# Altium project HexMatrix.PrjPcb
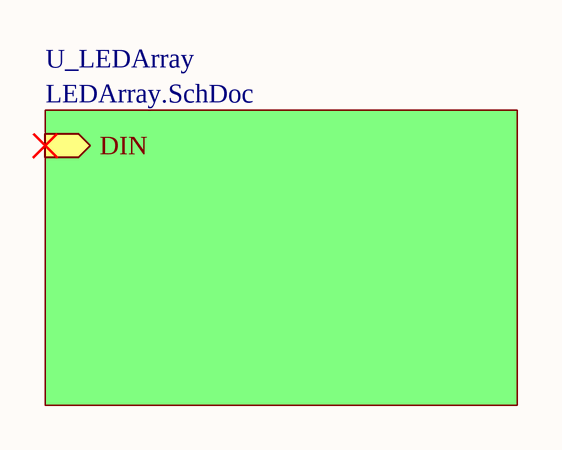
[diagram p0: Func.SchDoc]
3 sheets, 185 parts. Net scope: hierarchical (ports join the sheet entries above them; power ports are global).
Board file: RawLEDArray.PcbDoc
Sheets:
  Func.SchDoc
    U_LEDArray = LEDArray.SchDoc
      U_LED1 = LED.SchDoc
      U_LED2 = LED.SchDoc
      U_LED3 = LED.SchDoc
      U_LED4 = LED.SchDoc
      U_LED5 = LED.SchDoc
      U_LED6 = LED.SchDoc
      U_LED7 = LED.SchDoc
      U_LED8 = LED.SchDoc
      U_LED9 = LED.SchDoc
      U_LED10 = LED.SchDoc
      U_LED11 = LED.SchDoc
      U_LED12 = LED.SchDoc
      U_LED13 = LED.SchDoc
      U_LED14 = LED.SchDoc
      U_LED15 = LED.SchDoc
      U_LED16 = LED.SchDoc
      U_LED17 = LED.SchDoc
      U_LED18 = LED.SchDoc
      U_LED19 = LED.SchDoc
      U_LED20 = LED.SchDoc
      U_LED21 = LED.SchDoc
      U_LED22 = LED.SchDoc
      U_LED23 = LED.SchDoc
      U_LED24 = LED.SchDoc
      U_LED25 = LED.SchDoc
      U_LED26 = LED.SchDoc
      U_LED27 = LED.SchDoc
      U_LED28 = LED.SchDoc
      U_LED29 = LED.SchDoc
      U_LED30 = LED.SchDoc
      U_LED31 = LED.SchDoc
      U_LED32 = LED.SchDoc
      U_LED33 = LED.SchDoc
      U_LED34 = LED.SchDoc
      U_LED35 = LED.SchDoc
      U_LED36 = LED.SchDoc
      U_LED37 = LED.SchDoc
      U_LED38 = LED.SchDoc
      U_LED39 = LED.SchDoc
      U_LED40 = LED.SchDoc
      U_LED41 = LED.SchDoc
      U_LED42 = LED.SchDoc
      U_LED43 = LED.SchDoc
      U_LED44 = LED.SchDoc
      U_LED45 = LED.SchDoc
      U_LED46 = LED.SchDoc
      U_LED47 = LED.SchDoc
      U_LED48 = LED.SchDoc
      U_LED49 = LED.SchDoc
      U_LED50 = LED.SchDoc
      U_LED51 = LED.SchDoc
      U_LED52 = LED.SchDoc
      U_LED53 = LED.SchDoc
      U_LED54 = LED.SchDoc
      U_LED55 = LED.SchDoc
      U_LED56 = LED.SchDoc
      U_LED57 = LED.SchDoc
      U_LED58 = LED.SchDoc
      U_LED59 = LED.SchDoc
      U_LED60 = LED.SchDoc
      U_LED61 = LED.SchDoc
      U_LED62 = LED.SchDoc
      U_LED63 = LED.SchDoc
      U_LED64 = LED.SchDoc
      U_LED65 = LED.SchDoc
      U_LED66 = LED.SchDoc
      U_LED67 = LED.SchDoc
      U_LED68 = LED.SchDoc
      U_LED69 = LED.SchDoc
      U_LED70 = LED.SchDoc
      U_LED71 = LED.SchDoc
      U_LED72 = LED.SchDoc
      U_LED73 = LED.SchDoc
      U_LED74 = LED.SchDoc
      U_LED75 = LED.SchDoc
      U_LED76 = LED.SchDoc
      U_LED77 = LED.SchDoc
      U_LED78 = LED.SchDoc
      U_LED79 = LED.SchDoc
      U_LED80 = LED.SchDoc
      U_LED81 = LED.SchDoc
      U_LED82 = LED.SchDoc
      U_LED83 = LED.SchDoc
      U_LED84 = LED.SchDoc
      U_LED85 = LED.SchDoc
      U_LED86 = LED.SchDoc
      U_LED87 = LED.SchDoc
      U_LED88 = LED.SchDoc
      U_LED89 = LED.SchDoc
      U_LED90 = LED.SchDoc
      U_LED91 = LED.SchDoc
      U_LED92 = LED.SchDoc

## Sheet Func.SchDoc
size A4; DocumentNumber: 1; SheetNumber: 1; SheetTotal: 3

### Sub-sheets
U_LEDArray = LEDArray.SchDoc: DIN (in)

## Sheet LEDArray.SchDoc
size A4; DocumentNumber: 2; SheetNumber: 2; SheetTotal: 3
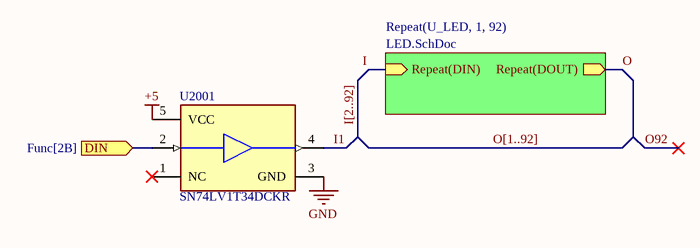
[diagram p1: LEDArray.SchDoc]

### Parts
U2001  SN74LV1T34DCKR  [FP-DCK0005A-IPC_C]

### Sub-sheets
Repeat(U_LED, 1, 92) = LED.SchDoc: Repeat(DOUT) (out), Repeat(DIN) (in)

### Ports
DIN (in, see Func[2B])

### Nets
+5: U2001.5(VCC)
GND: U2001.3(GND)
I: sheet Repeat(U_LED, 1, 92)/Repeat(DIN)
I1: U2001.4(Y)
O: sheet Repeat(U_LED, 1, 92)/Repeat(DOUT)
NetU2001_2: U2001.2(A) ; port DIN

Not connected (* = marked no-connect by the designer): U2001 1(NC)*

### Buses and harness runs
bus I[2..92] = O[1..92]

### Library data of the parts
U2001 = CMP-0859-00371-4: IC BUF NON-INVERT 5.5V SC70-5; Number of Outputs: 1; Polarity: Non-Inverting; Quiescent Current: 1uA; High Level Output Current: -8mA; Operating Supply Current: 8mA; Propagation Delay: 15.5ns; Logic Function: Buffer; Min Supply Voltage: 1.6V; Max Operating Temperature: 125°C; Weight: 0.000215oz; Number of Pins: 5; Number of Channels: 1; Mount: Surface Mount; Number of Input Lines: 1; Lead Free: Lead Free; Min Operating Temperature: -40°C; Radiation Hardening: No; Number of Inputs: 1; Number of Elements: 1; REACH SVHC: No SVHC; Packaging: Tape and Reel; Package Quantity: 3000; Case/Package: SC; Number of Bits: 1; Low Level Output Current: 8mA; Max Supply Voltage: 5.5V; Contact Plating: Gold; Number of Bits per Element: 1; Number of Output Lines: 1

## Sheet LED.SchDoc: WS2812B 8mm LED
size A4; DrawnBy: Denis Cooper; Engineer: Denis Cooper; DocumentNumber: 3; Revision: 0.1; SheetNumber: 3; SheetTotal: 3
Used 92 times, as channels U_LEDArray/U_LED1, U_LEDArray/U_LED2, U_LEDArray/U_LED3, U_LEDArray/U_LED4, U_LEDArray/U_LED5, U_LEDArray/U_LED6, U_LEDArray/U_LED7, U_LEDArray/U_LED8, U_LEDArray/U_LED9, U_LEDArray/U_LED10, U_LEDArray/U_LED11, U_LEDArray/U_LED12, U_LEDArray/U_LED13, U_LEDArray/U_LED14, U_LEDArray/U_LED15, U_LEDArray/U_LED16, U_LEDArray/U_LED17, U_LEDArray/U_LED18, U_LEDArray/U_LED19, U_LEDArray/U_LED20, U_LEDArray/U_LED21, U_LEDArray/U_LED22, U_LEDArray/U_LED23, U_LEDArray/U_LED24, U_LEDArray/U_LED25, U_LEDArray/U_LED26, U_LEDArray/U_LED27, U_LEDArray/U_LED28, U_LEDArray/U_LED29, U_LEDArray/U_LED30, U_LEDArray/U_LED31, U_LEDArray/U_LED32, U_LEDArray/U_LED33, U_LEDArray/U_LED34, U_LEDArray/U_LED35, U_LEDArray/U_LED36, U_LEDArray/U_LED37, U_LEDArray/U_LED38, U_LEDArray/U_LED39, U_LEDArray/U_LED40, U_LEDArray/U_LED41, U_LEDArray/U_LED42, U_LEDArray/U_LED43, U_LEDArray/U_LED44, U_LEDArray/U_LED45, U_LEDArray/U_LED46, U_LEDArray/U_LED47, U_LEDArray/U_LED48, U_LEDArray/U_LED49, U_LEDArray/U_LED50, U_LEDArray/U_LED51, U_LEDArray/U_LED52, U_LEDArray/U_LED53, U_LEDArray/U_LED54, U_LEDArray/U_LED55, U_LEDArray/U_LED56, U_LEDArray/U_LED57, U_LEDArray/U_LED58, U_LEDArray/U_LED59, U_LEDArray/U_LED60, U_LEDArray/U_LED61, U_LEDArray/U_LED62, U_LEDArray/U_LED63, U_LEDArray/U_LED64, U_LEDArray/U_LED65, U_LEDArray/U_LED66, U_LEDArray/U_LED67, U_LEDArray/U_LED68, U_LEDArray/U_LED69, U_LEDArray/U_LED70, U_LEDArray/U_LED71, U_LEDArray/U_LED72, U_LEDArray/U_LED73, U_LEDArray/U_LED74, U_LEDArray/U_LED75, U_LEDArray/U_LED76, U_LEDArray/U_LED77, U_LEDArray/U_LED78, U_LEDArray/U_LED79, U_LEDArray/U_LED80, U_LEDArray/U_LED81, U_LEDArray/U_LED82, U_LEDArray/U_LED83, U_LEDArray/U_LED84, U_LEDArray/U_LED85, U_LEDArray/U_LED86, U_LEDArray/U_LED87, U_LEDArray/U_LED88, U_LEDArray/U_LED89, U_LEDArray/U_LED90, U_LEDArray/U_LED91, U_LEDArray/U_LED92. Parts and nets are listed once, with the designators drawn on the sheet.
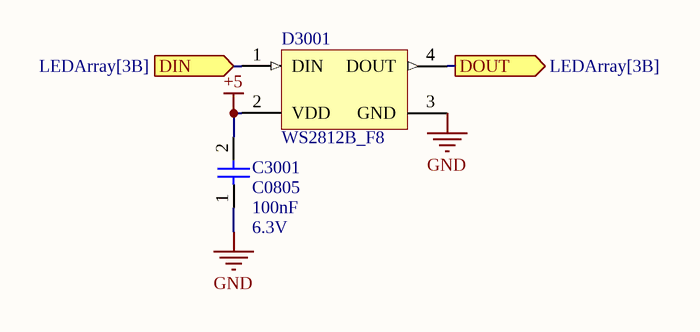
[diagram p2: LED.SchDoc]

### Parts
C3001  C0805  Capacitance: 100nF  Voltage: 6.3V  [CC0805]
D3001  WS2812B_F8  [WS2812B_F8]

### Ports
DIN (in, see LEDArray[3B]), DOUT (out, see LEDArray[3B])

### Nets
+5: C3001.2 D3001.2(VDD)
GND: C3001.1 D3001.3(GND)
DIN: D3001.1(DIN) ; port DIN
DOUT: D3001.4(DOUT) ; port DOUT

### Channels
U_LEDArray/U_LED1: designators end in _1; ports DIN=I1 DOUT=I2
U_LEDArray/U_LED2: designators end in _2; ports DIN=I2 DOUT=I3
U_LEDArray/U_LED3: designators end in _3; ports DIN=I3 DOUT=I4
U_LEDArray/U_LED4: designators end in _4; ports DIN=I4 DOUT=I5
U_LEDArray/U_LED5: designators end in _5; ports DIN=I5 DOUT=I6
U_LEDArray/U_LED6: designators end in _6; ports DIN=I6 DOUT=I7
U_LEDArray/U_LED7: designators end in _7; ports DIN=I7 DOUT=I8
U_LEDArray/U_LED8: designators end in _8; ports DIN=I8 DOUT=I9
U_LEDArray/U_LED9: designators end in _9; ports DIN=I9 DOUT=I10
U_LEDArray/U_LED10: designators end in _10; ports DIN=I10 DOUT=I11
U_LEDArray/U_LED11: designators end in _11; ports DIN=I11 DOUT=I12
U_LEDArray/U_LED12: designators end in _12; ports DIN=I12 DOUT=I13
U_LEDArray/U_LED13: designators end in _13; ports DIN=I13 DOUT=I14
U_LEDArray/U_LED14: designators end in _14; ports DIN=I14 DOUT=I15
U_LEDArray/U_LED15: designators end in _15; ports DIN=I15 DOUT=I16
U_LEDArray/U_LED16: designators end in _16; ports DIN=I16 DOUT=I17
U_LEDArray/U_LED17: designators end in _17; ports DIN=I17 DOUT=I18
U_LEDArray/U_LED18: designators end in _18; ports DIN=I18 DOUT=I19
U_LEDArray/U_LED19: designators end in _19; ports DIN=I19 DOUT=I20
U_LEDArray/U_LED20: designators end in _20; ports DIN=I20 DOUT=I21
U_LEDArray/U_LED21: designators end in _21; ports DIN=I21 DOUT=I22
U_LEDArray/U_LED22: designators end in _22; ports DIN=I22 DOUT=I23
U_LEDArray/U_LED23: designators end in _23; ports DIN=I23 DOUT=I24
U_LEDArray/U_LED24: designators end in _24; ports DIN=I24 DOUT=I25
U_LEDArray/U_LED25: designators end in _25; ports DIN=I25 DOUT=I26
U_LEDArray/U_LED26: designators end in _26; ports DIN=I26 DOUT=I27
U_LEDArray/U_LED27: designators end in _27; ports DIN=I27 DOUT=I28
U_LEDArray/U_LED28: designators end in _28; ports DIN=I28 DOUT=I29
U_LEDArray/U_LED29: designators end in _29; ports DIN=I29 DOUT=I30
U_LEDArray/U_LED30: designators end in _30; ports DIN=I30 DOUT=I31
U_LEDArray/U_LED31: designators end in _31; ports DIN=I31 DOUT=I32
U_LEDArray/U_LED32: designators end in _32; ports DIN=I32 DOUT=I33
U_LEDArray/U_LED33: designators end in _33; ports DIN=I33 DOUT=I34
U_LEDArray/U_LED34: designators end in _34; ports DIN=I34 DOUT=I35
U_LEDArray/U_LED35: designators end in _35; ports DIN=I35 DOUT=I36
U_LEDArray/U_LED36: designators end in _36; ports DIN=I36 DOUT=I37
U_LEDArray/U_LED37: designators end in _37; ports DIN=I37 DOUT=I38
U_LEDArray/U_LED38: designators end in _38; ports DIN=I38 DOUT=I39
U_LEDArray/U_LED39: designators end in _39; ports DIN=I39 DOUT=I40
U_LEDArray/U_LED40: designators end in _40; ports DIN=I40 DOUT=I41
U_LEDArray/U_LED41: designators end in _41; ports DIN=I41 DOUT=I42
U_LEDArray/U_LED42: designators end in _42; ports DIN=I42 DOUT=I43
U_LEDArray/U_LED43: designators end in _43; ports DIN=I43 DOUT=I44
U_LEDArray/U_LED44: designators end in _44; ports DIN=I44 DOUT=I45
U_LEDArray/U_LED45: designators end in _45; ports DIN=I45 DOUT=I46
U_LEDArray/U_LED46: designators end in _46; ports DIN=I46 DOUT=I47
U_LEDArray/U_LED47: designators end in _47; ports DIN=I47 DOUT=I48
U_LEDArray/U_LED48: designators end in _48; ports DIN=I48 DOUT=I49
U_LEDArray/U_LED49: designators end in _49; ports DIN=I49 DOUT=I50
U_LEDArray/U_LED50: designators end in _50; ports DIN=I50 DOUT=I51
U_LEDArray/U_LED51: designators end in _51; ports DIN=I51 DOUT=I52
U_LEDArray/U_LED52: designators end in _52; ports DIN=I52 DOUT=I53
U_LEDArray/U_LED53: designators end in _53; ports DIN=I53 DOUT=I54
U_LEDArray/U_LED54: designators end in _54; ports DIN=I54 DOUT=I55
U_LEDArray/U_LED55: designators end in _55; ports DIN=I55 DOUT=I56
U_LEDArray/U_LED56: designators end in _56; ports DIN=I56 DOUT=I57
U_LEDArray/U_LED57: designators end in _57; ports DIN=I57 DOUT=I58
U_LEDArray/U_LED58: designators end in _58; ports DIN=I58 DOUT=I59
U_LEDArray/U_LED59: designators end in _59; ports DIN=I59 DOUT=I60
U_LEDArray/U_LED60: designators end in _60; ports DIN=I60 DOUT=I61
U_LEDArray/U_LED61: designators end in _61; ports DIN=I61 DOUT=I62
U_LEDArray/U_LED62: designators end in _62; ports DIN=I62 DOUT=I63
U_LEDArray/U_LED63: designators end in _63; ports DIN=I63 DOUT=I64
U_LEDArray/U_LED64: designators end in _64; ports DIN=I64 DOUT=I65
U_LEDArray/U_LED65: designators end in _65; ports DIN=I65 DOUT=I66
U_LEDArray/U_LED66: designators end in _66; ports DIN=I66 DOUT=I67
U_LEDArray/U_LED67: designators end in _67; ports DIN=I67 DOUT=I68
U_LEDArray/U_LED68: designators end in _68; ports DIN=I68 DOUT=I69
U_LEDArray/U_LED69: designators end in _69; ports DIN=I69 DOUT=I70
U_LEDArray/U_LED70: designators end in _70; ports DIN=I70 DOUT=I71
U_LEDArray/U_LED71: designators end in _71; ports DIN=I71 DOUT=I72
U_LEDArray/U_LED72: designators end in _72; ports DIN=I72 DOUT=I73
U_LEDArray/U_LED73: designators end in _73; ports DIN=I73 DOUT=I74
U_LEDArray/U_LED74: designators end in _74; ports DIN=I74 DOUT=I75
U_LEDArray/U_LED75: designators end in _75; ports DIN=I75 DOUT=I76
U_LEDArray/U_LED76: designators end in _76; ports DIN=I76 DOUT=I77
U_LEDArray/U_LED77: designators end in _77; ports DIN=I77 DOUT=I78
U_LEDArray/U_LED78: designators end in _78; ports DIN=I78 DOUT=I79
U_LEDArray/U_LED79: designators end in _79; ports DIN=I79 DOUT=I80
U_LEDArray/U_LED80: designators end in _80; ports DIN=I80 DOUT=I81
U_LEDArray/U_LED81: designators end in _81; ports DIN=I81 DOUT=I82
U_LEDArray/U_LED82: designators end in _82; ports DIN=I82 DOUT=I83
U_LEDArray/U_LED83: designators end in _83; ports DIN=I83 DOUT=I84
U_LEDArray/U_LED84: designators end in _84; ports DIN=I84 DOUT=I85
U_LEDArray/U_LED85: designators end in _85; ports DIN=I85 DOUT=I86
U_LEDArray/U_LED86: designators end in _86; ports DIN=I86 DOUT=I87
U_LEDArray/U_LED87: designators end in _87; ports DIN=I87 DOUT=I88
U_LEDArray/U_LED88: designators end in _88; ports DIN=I88 DOUT=I89
U_LEDArray/U_LED89: designators end in _89; ports DIN=I89 DOUT=I90
U_LEDArray/U_LED90: designators end in _90; ports DIN=I90 DOUT=I91
U_LEDArray/U_LED91: designators end in _91; ports DIN=I91 DOUT=I92
U_LEDArray/U_LED92: designators end in _92; ports DIN=I92 DOUT=O92

### Library data of the parts
C3001 = C0805: Capacitor; Tolerance: ±?%
D3001 = WS2812B_F8: Addressable 8mm LED; Voltage: 5V

## Nets that join several sheets
+5: LEDArray (U2001.5), U_LEDArray/U_LED1 (C3001_1.2 D3001_1.2), U_LEDArray/U_LED2 (C3001_2.2 D3001_2.2), U_LEDArray/U_LED3 (C3001_3.2 D3001_3.2), U_LEDArray/U_LED4 (C3001_4.2 D3001_4.2), U_LEDArray/U_LED5 (C3001_5.2 D3001_5.2), U_LEDArray/U_LED6 (C3001_6.2 D3001_6.2), U_LEDArray/U_LED7 (C3001_7.2 D3001_7.2), U_LEDArray/U_LED8 (C3001_8.2 D3001_8.2), U_LEDArray/U_LED9 (C3001_9.2 D3001_9.2), U_LEDArray/U_LED10 (C3001_10.2 D3001_10.2), U_LEDArray/U_LED11 (C3001_11.2 D3001_11.2), U_LEDArray/U_LED12 (C3001_12.2 D3001_12.2), U_LEDArray/U_LED13 (C3001_13.2 D3001_13.2), U_LEDArray/U_LED14 (C3001_14.2 D3001_14.2), U_LEDArray/U_LED15 (C3001_15.2 D3001_15.2), U_LEDArray/U_LED16 (C3001_16.2 D3001_16.2), U_LEDArray/U_LED17 (C3001_17.2 D3001_17.2), U_LEDArray/U_LED18 (C3001_18.2 D3001_18.2), U_LEDArray/U_LED19 (C3001_19.2 D3001_19.2), U_LEDArray/U_LED20 (C3001_20.2 D3001_20.2), U_LEDArray/U_LED21 (C3001_21.2 D3001_21.2), U_LEDArray/U_LED22 (C3001_22.2 D3001_22.2), U_LEDArray/U_LED23 (C3001_23.2 D3001_23.2), U_LEDArray/U_LED24 (C3001_24.2 D3001_24.2), U_LEDArray/U_LED25 (C3001_25.2 D3001_25.2), U_LEDArray/U_LED26 (C3001_26.2 D3001_26.2), U_LEDArray/U_LED27 (C3001_27.2 D3001_27.2), U_LEDArray/U_LED28 (C3001_28.2 D3001_28.2), U_LEDArray/U_LED29 (C3001_29.2 D3001_29.2), U_LEDArray/U_LED30 (C3001_30.2 D3001_30.2), U_LEDArray/U_LED31 (C3001_31.2 D3001_31.2), U_LEDArray/U_LED32 (C3001_32.2 D3001_32.2), U_LEDArray/U_LED33 (C3001_33.2 D3001_33.2), U_LEDArray/U_LED34 (C3001_34.2 D3001_34.2), U_LEDArray/U_LED35 (C3001_35.2 D3001_35.2), U_LEDArray/U_LED36 (C3001_36.2 D3001_36.2), U_LEDArray/U_LED37 (C3001_37.2 D3001_37.2), U_LEDArray/U_LED38 (C3001_38.2 D3001_38.2), U_LEDArray/U_LED39 (C3001_39.2 D3001_39.2), U_LEDArray/U_LED40 (C3001_40.2 D3001_40.2), U_LEDArray/U_LED41 (C3001_41.2 D3001_41.2), U_LEDArray/U_LED42 (C3001_42.2 D3001_42.2), U_LEDArray/U_LED43 (C3001_43.2 D3001_43.2), U_LEDArray/U_LED44 (C3001_44.2 D3001_44.2), U_LEDArray/U_LED45 (C3001_45.2 D3001_45.2), U_LEDArray/U_LED46 (C3001_46.2 D3001_46.2), U_LEDArray/U_LED47 (C3001_47.2 D3001_47.2), U_LEDArray/U_LED48 (C3001_48.2 D3001_48.2), U_LEDArray/U_LED49 (C3001_49.2 D3001_49.2), U_LEDArray/U_LED50 (C3001_50.2 D3001_50.2), U_LEDArray/U_LED51 (C3001_51.2 D3001_51.2), U_LEDArray/U_LED52 (C3001_52.2 D3001_52.2), U_LEDArray/U_LED53 (C3001_53.2 D3001_53.2), U_LEDArray/U_LED54 (C3001_54.2 D3001_54.2), U_LEDArray/U_LED55 (C3001_55.2 D3001_55.2), U_LEDArray/U_LED56 (C3001_56.2 D3001_56.2), U_LEDArray/U_LED57 (C3001_57.2 D3001_57.2), U_LEDArray/U_LED58 (C3001_58.2 D3001_58.2), U_LEDArray/U_LED59 (C3001_59.2 D3001_59.2), U_LEDArray/U_LED60 (C3001_60.2 D3001_60.2), U_LEDArray/U_LED61 (C3001_61.2 D3001_61.2), U_LEDArray/U_LED62 (C3001_62.2 D3001_62.2), U_LEDArray/U_LED63 (C3001_63.2 D3001_63.2), U_LEDArray/U_LED64 (C3001_64.2 D3001_64.2), U_LEDArray/U_LED65 (C3001_65.2 D3001_65.2), U_LEDArray/U_LED66 (C3001_66.2 D3001_66.2), U_LEDArray/U_LED67 (C3001_67.2 D3001_67.2), U_LEDArray/U_LED68 (C3001_68.2 D3001_68.2), U_LEDArray/U_LED69 (C3001_69.2 D3001_69.2), U_LEDArray/U_LED70 (C3001_70.2 D3001_70.2), U_LEDArray/U_LED71 (C3001_71.2 D3001_71.2), U_LEDArray/U_LED72 (C3001_72.2 D3001_72.2), U_LEDArray/U_LED73 (C3001_73.2 D3001_73.2), U_LEDArray/U_LED74 (C3001_74.2 D3001_74.2), U_LEDArray/U_LED75 (C3001_75.2 D3001_75.2), U_LEDArray/U_LED76 (C3001_76.2 D3001_76.2), U_LEDArray/U_LED77 (C3001_77.2 D3001_77.2), U_LEDArray/U_LED78 (C3001_78.2 D3001_78.2), U_LEDArray/U_LED79 (C3001_79.2 D3001_79.2), U_LEDArray/U_LED80 (C3001_80.2 D3001_80.2), U_LEDArray/U_LED81 (C3001_81.2 D3001_81.2), U_LEDArray/U_LED82 (C3001_82.2 D3001_82.2), U_LEDArray/U_LED83 (C3001_83.2 D3001_83.2), U_LEDArray/U_LED84 (C3001_84.2 D3001_84.2), U_LEDArray/U_LED85 (C3001_85.2 D3001_85.2), U_LEDArray/U_LED86 (C3001_86.2 D3001_86.2), U_LEDArray/U_LED87 (C3001_87.2 D3001_87.2), U_LEDArray/U_LED88 (C3001_88.2 D3001_88.2), U_LEDArray/U_LED89 (C3001_89.2 D3001_89.2), U_LEDArray/U_LED90 (C3001_90.2 D3001_90.2), U_LEDArray/U_LED91 (C3001_91.2 D3001_91.2), U_LEDArray/U_LED92 (C3001_92.2 D3001_92.2)
GND: LEDArray (U2001.3), U_LEDArray/U_LED1 (C3001_1.1 D3001_1.3), U_LEDArray/U_LED2 (C3001_2.1 D3001_2.3), U_LEDArray/U_LED3 (C3001_3.1 D3001_3.3), U_LEDArray/U_LED4 (C3001_4.1 D3001_4.3), U_LEDArray/U_LED5 (C3001_5.1 D3001_5.3), U_LEDArray/U_LED6 (C3001_6.1 D3001_6.3), U_LEDArray/U_LED7 (C3001_7.1 D3001_7.3), U_LEDArray/U_LED8 (C3001_8.1 D3001_8.3), U_LEDArray/U_LED9 (C3001_9.1 D3001_9.3), U_LEDArray/U_LED10 (C3001_10.1 D3001_10.3), U_LEDArray/U_LED11 (C3001_11.1 D3001_11.3), U_LEDArray/U_LED12 (C3001_12.1 D3001_12.3), U_LEDArray/U_LED13 (C3001_13.1 D3001_13.3), U_LEDArray/U_LED14 (C3001_14.1 D3001_14.3), U_LEDArray/U_LED15 (C3001_15.1 D3001_15.3), U_LEDArray/U_LED16 (C3001_16.1 D3001_16.3), U_LEDArray/U_LED17 (C3001_17.1 D3001_17.3), U_LEDArray/U_LED18 (C3001_18.1 D3001_18.3), U_LEDArray/U_LED19 (C3001_19.1 D3001_19.3), U_LEDArray/U_LED20 (C3001_20.1 D3001_20.3), U_LEDArray/U_LED21 (C3001_21.1 D3001_21.3), U_LEDArray/U_LED22 (C3001_22.1 D3001_22.3), U_LEDArray/U_LED23 (C3001_23.1 D3001_23.3), U_LEDArray/U_LED24 (C3001_24.1 D3001_24.3), U_LEDArray/U_LED25 (C3001_25.1 D3001_25.3), U_LEDArray/U_LED26 (C3001_26.1 D3001_26.3), U_LEDArray/U_LED27 (C3001_27.1 D3001_27.3), U_LEDArray/U_LED28 (C3001_28.1 D3001_28.3), U_LEDArray/U_LED29 (C3001_29.1 D3001_29.3), U_LEDArray/U_LED30 (C3001_30.1 D3001_30.3), U_LEDArray/U_LED31 (C3001_31.1 D3001_31.3), U_LEDArray/U_LED32 (C3001_32.1 D3001_32.3), U_LEDArray/U_LED33 (C3001_33.1 D3001_33.3), U_LEDArray/U_LED34 (C3001_34.1 D3001_34.3), U_LEDArray/U_LED35 (C3001_35.1 D3001_35.3), U_LEDArray/U_LED36 (C3001_36.1 D3001_36.3), U_LEDArray/U_LED37 (C3001_37.1 D3001_37.3), U_LEDArray/U_LED38 (C3001_38.1 D3001_38.3), U_LEDArray/U_LED39 (C3001_39.1 D3001_39.3), U_LEDArray/U_LED40 (C3001_40.1 D3001_40.3), U_LEDArray/U_LED41 (C3001_41.1 D3001_41.3), U_LEDArray/U_LED42 (C3001_42.1 D3001_42.3), U_LEDArray/U_LED43 (C3001_43.1 D3001_43.3), U_LEDArray/U_LED44 (C3001_44.1 D3001_44.3), U_LEDArray/U_LED45 (C3001_45.1 D3001_45.3), U_LEDArray/U_LED46 (C3001_46.1 D3001_46.3), U_LEDArray/U_LED47 (C3001_47.1 D3001_47.3), U_LEDArray/U_LED48 (C3001_48.1 D3001_48.3), U_LEDArray/U_LED49 (C3001_49.1 D3001_49.3), U_LEDArray/U_LED50 (C3001_50.1 D3001_50.3), U_LEDArray/U_LED51 (C3001_51.1 D3001_51.3), U_LEDArray/U_LED52 (C3001_52.1 D3001_52.3), U_LEDArray/U_LED53 (C3001_53.1 D3001_53.3), U_LEDArray/U_LED54 (C3001_54.1 D3001_54.3), U_LEDArray/U_LED55 (C3001_55.1 D3001_55.3), U_LEDArray/U_LED56 (C3001_56.1 D3001_56.3), U_LEDArray/U_LED57 (C3001_57.1 D3001_57.3), U_LEDArray/U_LED58 (C3001_58.1 D3001_58.3), U_LEDArray/U_LED59 (C3001_59.1 D3001_59.3), U_LEDArray/U_LED60 (C3001_60.1 D3001_60.3), U_LEDArray/U_LED61 (C3001_61.1 D3001_61.3), U_LEDArray/U_LED62 (C3001_62.1 D3001_62.3), U_LEDArray/U_LED63 (C3001_63.1 D3001_63.3), U_LEDArray/U_LED64 (C3001_64.1 D3001_64.3), U_LEDArray/U_LED65 (C3001_65.1 D3001_65.3), U_LEDArray/U_LED66 (C3001_66.1 D3001_66.3), U_LEDArray/U_LED67 (C3001_67.1 D3001_67.3), U_LEDArray/U_LED68 (C3001_68.1 D3001_68.3), U_LEDArray/U_LED69 (C3001_69.1 D3001_69.3), U_LEDArray/U_LED70 (C3001_70.1 D3001_70.3), U_LEDArray/U_LED71 (C3001_71.1 D3001_71.3), U_LEDArray/U_LED72 (C3001_72.1 D3001_72.3), U_LEDArray/U_LED73 (C3001_73.1 D3001_73.3), U_LEDArray/U_LED74 (C3001_74.1 D3001_74.3), U_LEDArray/U_LED75 (C3001_75.1 D3001_75.3), U_LEDArray/U_LED76 (C3001_76.1 D3001_76.3), U_LEDArray/U_LED77 (C3001_77.1 D3001_77.3), U_LEDArray/U_LED78 (C3001_78.1 D3001_78.3), U_LEDArray/U_LED79 (C3001_79.1 D3001_79.3), U_LEDArray/U_LED80 (C3001_80.1 D3001_80.3), U_LEDArray/U_LED81 (C3001_81.1 D3001_81.3), U_LEDArray/U_LED82 (C3001_82.1 D3001_82.3), U_LEDArray/U_LED83 (C3001_83.1 D3001_83.3), U_LEDArray/U_LED84 (C3001_84.1 D3001_84.3), U_LEDArray/U_LED85 (C3001_85.1 D3001_85.3), U_LEDArray/U_LED86 (C3001_86.1 D3001_86.3), U_LEDArray/U_LED87 (C3001_87.1 D3001_87.3), U_LEDArray/U_LED88 (C3001_88.1 D3001_88.3), U_LEDArray/U_LED89 (C3001_89.1 D3001_89.3), U_LEDArray/U_LED90 (C3001_90.1 D3001_90.3), U_LEDArray/U_LED91 (C3001_91.1 D3001_91.3), U_LEDArray/U_LED92 (C3001_92.1 D3001_92.3)
I1: LEDArray (U2001.4), U_LEDArray/U_LED1 (D3001_1.1)
I2: U_LEDArray/U_LED1 (D3001_1.4), U_LEDArray/U_LED2 (D3001_2.1)
I3: U_LEDArray/U_LED2 (D3001_2.4), U_LEDArray/U_LED3 (D3001_3.1)
I4: U_LEDArray/U_LED3 (D3001_3.4), U_LEDArray/U_LED4 (D3001_4.1)
I5: U_LEDArray/U_LED4 (D3001_4.4), U_LEDArray/U_LED5 (D3001_5.1)
I6: U_LEDArray/U_LED5 (D3001_5.4), U_LEDArray/U_LED6 (D3001_6.1)
I7: U_LEDArray/U_LED6 (D3001_6.4), U_LEDArray/U_LED7 (D3001_7.1)
I8: U_LEDArray/U_LED7 (D3001_7.4), U_LEDArray/U_LED8 (D3001_8.1)
I9: U_LEDArray/U_LED8 (D3001_8.4), U_LEDArray/U_LED9 (D3001_9.1)
I10: U_LEDArray/U_LED9 (D3001_9.4), U_LEDArray/U_LED10 (D3001_10.1)
I11: U_LEDArray/U_LED10 (D3001_10.4), U_LEDArray/U_LED11 (D3001_11.1)
I12: U_LEDArray/U_LED11 (D3001_11.4), U_LEDArray/U_LED12 (D3001_12.1)
I13: U_LEDArray/U_LED12 (D3001_12.4), U_LEDArray/U_LED13 (D3001_13.1)
I14: U_LEDArray/U_LED13 (D3001_13.4), U_LEDArray/U_LED14 (D3001_14.1)
I15: U_LEDArray/U_LED14 (D3001_14.4), U_LEDArray/U_LED15 (D3001_15.1)
I16: U_LEDArray/U_LED15 (D3001_15.4), U_LEDArray/U_LED16 (D3001_16.1)
I17: U_LEDArray/U_LED16 (D3001_16.4), U_LEDArray/U_LED17 (D3001_17.1)
I18: U_LEDArray/U_LED17 (D3001_17.4), U_LEDArray/U_LED18 (D3001_18.1)
I19: U_LEDArray/U_LED18 (D3001_18.4), U_LEDArray/U_LED19 (D3001_19.1)
I20: U_LEDArray/U_LED19 (D3001_19.4), U_LEDArray/U_LED20 (D3001_20.1)
I21: U_LEDArray/U_LED20 (D3001_20.4), U_LEDArray/U_LED21 (D3001_21.1)
I22: U_LEDArray/U_LED21 (D3001_21.4), U_LEDArray/U_LED22 (D3001_22.1)
I23: U_LEDArray/U_LED22 (D3001_22.4), U_LEDArray/U_LED23 (D3001_23.1)
I24: U_LEDArray/U_LED23 (D3001_23.4), U_LEDArray/U_LED24 (D3001_24.1)
I25: U_LEDArray/U_LED24 (D3001_24.4), U_LEDArray/U_LED25 (D3001_25.1)
I26: U_LEDArray/U_LED25 (D3001_25.4), U_LEDArray/U_LED26 (D3001_26.1)
I27: U_LEDArray/U_LED26 (D3001_26.4), U_LEDArray/U_LED27 (D3001_27.1)
I28: U_LEDArray/U_LED27 (D3001_27.4), U_LEDArray/U_LED28 (D3001_28.1)
I29: U_LEDArray/U_LED28 (D3001_28.4), U_LEDArray/U_LED29 (D3001_29.1)
I30: U_LEDArray/U_LED29 (D3001_29.4), U_LEDArray/U_LED30 (D3001_30.1)
I31: U_LEDArray/U_LED30 (D3001_30.4), U_LEDArray/U_LED31 (D3001_31.1)
I32: U_LEDArray/U_LED31 (D3001_31.4), U_LEDArray/U_LED32 (D3001_32.1)
I33: U_LEDArray/U_LED32 (D3001_32.4), U_LEDArray/U_LED33 (D3001_33.1)
I34: U_LEDArray/U_LED33 (D3001_33.4), U_LEDArray/U_LED34 (D3001_34.1)
I35: U_LEDArray/U_LED34 (D3001_34.4), U_LEDArray/U_LED35 (D3001_35.1)
I36: U_LEDArray/U_LED35 (D3001_35.4), U_LEDArray/U_LED36 (D3001_36.1)
I37: U_LEDArray/U_LED36 (D3001_36.4), U_LEDArray/U_LED37 (D3001_37.1)
I38: U_LEDArray/U_LED37 (D3001_37.4), U_LEDArray/U_LED38 (D3001_38.1)
I39: U_LEDArray/U_LED38 (D3001_38.4), U_LEDArray/U_LED39 (D3001_39.1)
I40: U_LEDArray/U_LED39 (D3001_39.4), U_LEDArray/U_LED40 (D3001_40.1)
I41: U_LEDArray/U_LED40 (D3001_40.4), U_LEDArray/U_LED41 (D3001_41.1)
I42: U_LEDArray/U_LED41 (D3001_41.4), U_LEDArray/U_LED42 (D3001_42.1)
I43: U_LEDArray/U_LED42 (D3001_42.4), U_LEDArray/U_LED43 (D3001_43.1)
I44: U_LEDArray/U_LED43 (D3001_43.4), U_LEDArray/U_LED44 (D3001_44.1)
I45: U_LEDArray/U_LED44 (D3001_44.4), U_LEDArray/U_LED45 (D3001_45.1)
I46: U_LEDArray/U_LED45 (D3001_45.4), U_LEDArray/U_LED46 (D3001_46.1)
I47: U_LEDArray/U_LED46 (D3001_46.4), U_LEDArray/U_LED47 (D3001_47.1)
I48: U_LEDArray/U_LED47 (D3001_47.4), U_LEDArray/U_LED48 (D3001_48.1)
I49: U_LEDArray/U_LED48 (D3001_48.4), U_LEDArray/U_LED49 (D3001_49.1)
I50: U_LEDArray/U_LED49 (D3001_49.4), U_LEDArray/U_LED50 (D3001_50.1)
I51: U_LEDArray/U_LED50 (D3001_50.4), U_LEDArray/U_LED51 (D3001_51.1)
I52: U_LEDArray/U_LED51 (D3001_51.4), U_LEDArray/U_LED52 (D3001_52.1)
I53: U_LEDArray/U_LED52 (D3001_52.4), U_LEDArray/U_LED53 (D3001_53.1)
I54: U_LEDArray/U_LED53 (D3001_53.4), U_LEDArray/U_LED54 (D3001_54.1)
I55: U_LEDArray/U_LED54 (D3001_54.4), U_LEDArray/U_LED55 (D3001_55.1)
I56: U_LEDArray/U_LED55 (D3001_55.4), U_LEDArray/U_LED56 (D3001_56.1)
I57: U_LEDArray/U_LED56 (D3001_56.4), U_LEDArray/U_LED57 (D3001_57.1)
I58: U_LEDArray/U_LED57 (D3001_57.4), U_LEDArray/U_LED58 (D3001_58.1)
I59: U_LEDArray/U_LED58 (D3001_58.4), U_LEDArray/U_LED59 (D3001_59.1)
I60: U_LEDArray/U_LED59 (D3001_59.4), U_LEDArray/U_LED60 (D3001_60.1)
I61: U_LEDArray/U_LED60 (D3001_60.4), U_LEDArray/U_LED61 (D3001_61.1)
I62: U_LEDArray/U_LED61 (D3001_61.4), U_LEDArray/U_LED62 (D3001_62.1)
I63: U_LEDArray/U_LED62 (D3001_62.4), U_LEDArray/U_LED63 (D3001_63.1)
I64: U_LEDArray/U_LED63 (D3001_63.4), U_LEDArray/U_LED64 (D3001_64.1)
I65: U_LEDArray/U_LED64 (D3001_64.4), U_LEDArray/U_LED65 (D3001_65.1)
I66: U_LEDArray/U_LED65 (D3001_65.4), U_LEDArray/U_LED66 (D3001_66.1)
I67: U_LEDArray/U_LED66 (D3001_66.4), U_LEDArray/U_LED67 (D3001_67.1)
I68: U_LEDArray/U_LED67 (D3001_67.4), U_LEDArray/U_LED68 (D3001_68.1)
I69: U_LEDArray/U_LED68 (D3001_68.4), U_LEDArray/U_LED69 (D3001_69.1)
I70: U_LEDArray/U_LED69 (D3001_69.4), U_LEDArray/U_LED70 (D3001_70.1)
I71: U_LEDArray/U_LED70 (D3001_70.4), U_LEDArray/U_LED71 (D3001_71.1)
I72: U_LEDArray/U_LED71 (D3001_71.4), U_LEDArray/U_LED72 (D3001_72.1)
I73: U_LEDArray/U_LED72 (D3001_72.4), U_LEDArray/U_LED73 (D3001_73.1)
I74: U_LEDArray/U_LED73 (D3001_73.4), U_LEDArray/U_LED74 (D3001_74.1)
I75: U_LEDArray/U_LED74 (D3001_74.4), U_LEDArray/U_LED75 (D3001_75.1)
I76: U_LEDArray/U_LED75 (D3001_75.4), U_LEDArray/U_LED76 (D3001_76.1)
I77: U_LEDArray/U_LED76 (D3001_76.4), U_LEDArray/U_LED77 (D3001_77.1)
I78: U_LEDArray/U_LED77 (D3001_77.4), U_LEDArray/U_LED78 (D3001_78.1)
I79: U_LEDArray/U_LED78 (D3001_78.4), U_LEDArray/U_LED79 (D3001_79.1)
I80: U_LEDArray/U_LED79 (D3001_79.4), U_LEDArray/U_LED80 (D3001_80.1)
I81: U_LEDArray/U_LED80 (D3001_80.4), U_LEDArray/U_LED81 (D3001_81.1)
I82: U_LEDArray/U_LED81 (D3001_81.4), U_LEDArray/U_LED82 (D3001_82.1)
I83: U_LEDArray/U_LED82 (D3001_82.4), U_LEDArray/U_LED83 (D3001_83.1)
I84: U_LEDArray/U_LED83 (D3001_83.4), U_LEDArray/U_LED84 (D3001_84.1)
I85: U_LEDArray/U_LED84 (D3001_84.4), U_LEDArray/U_LED85 (D3001_85.1)
I86: U_LEDArray/U_LED85 (D3001_85.4), U_LEDArray/U_LED86 (D3001_86.1)
I87: U_LEDArray/U_LED86 (D3001_86.4), U_LEDArray/U_LED87 (D3001_87.1)
I88: U_LEDArray/U_LED87 (D3001_87.4), U_LEDArray/U_LED88 (D3001_88.1)
I89: U_LEDArray/U_LED88 (D3001_88.4), U_LEDArray/U_LED89 (D3001_89.1)
I90: U_LEDArray/U_LED89 (D3001_89.4), U_LEDArray/U_LED90 (D3001_90.1)
I91: U_LEDArray/U_LED90 (D3001_90.4), U_LEDArray/U_LED91 (D3001_91.1)
I92: U_LEDArray/U_LED91 (D3001_91.4), U_LEDArray/U_LED92 (D3001_92.1)